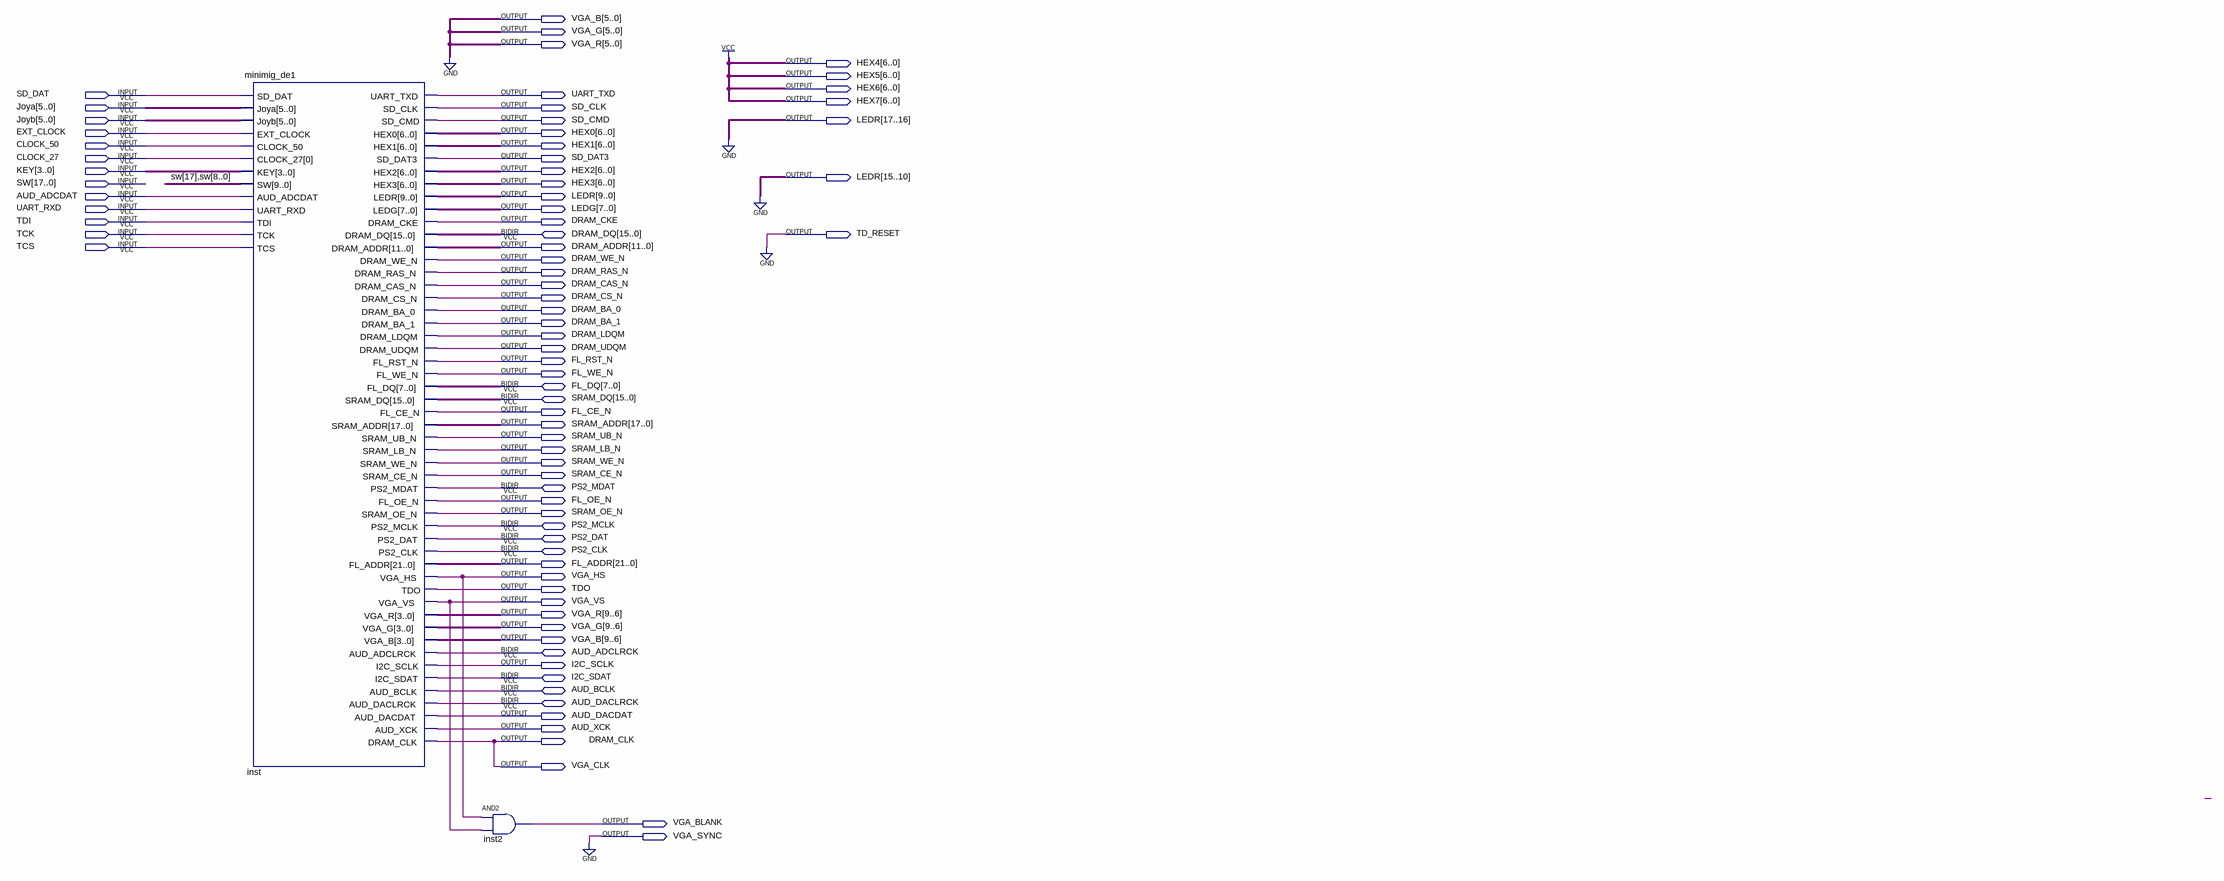
[diagram p0: schematic sheet]
// Quartus schematic minimig_de2.bdf as structural Verilog: 2 symbols, 78 pins
module minimig_de2 (
  input  SD_DAT,
  input  [5:0] Joya,
  input  [5:0] Joyb,
  input  EXT_CLOCK,
  input  CLOCK_50,
  input  CLOCK_27,
  input  [3:0] KEY,
  input  [17:0] SW,
  input  AUD_ADCDAT,
  input  UART_RXD,
  input  TDI,
  input  TCK,
  input  TCS,
  inout  [15:0] DRAM_DQ,
  inout  [7:0] FL_DQ,
  inout  [15:0] SRAM_DQ,
  inout  PS2_MDAT,
  inout  PS2_MCLK,
  inout  PS2_DAT,
  inout  PS2_CLK,
  inout  AUD_ADCLRCK,
  inout  I2C_SDAT,
  inout  AUD_BCLK,
  inout  AUD_DACLRCK,
  output [9:0] VGA_B,
  output [9:0] VGA_G,
  output [9:0] VGA_R,
  output [6:0] HEX4,
  output [6:0] HEX5,
  output [6:0] HEX6,
  output UART_TXD,
  output [6:0] HEX7,
  output SD_CLK,
  output SD_CMD,
  output [17:0] LEDR,
  output [6:0] HEX0,
  output [6:0] HEX1,
  output SD_DAT3,
  output [6:0] HEX2,
  output [6:0] HEX3,
  output [7:0] LEDG,
  output DRAM_CKE,
  output TD_RESET,
  output [11:0] DRAM_ADDR,
  output DRAM_WE_N,
  output DRAM_RAS_N,
  output DRAM_CAS_N,
  output DRAM_CS_N,
  output DRAM_BA_0,
  output DRAM_BA_1,
  output DRAM_LDQM,
  output DRAM_UDQM,
  output FL_RST_N,
  output FL_WE_N,
  output FL_CE_N,
  output [17:0] SRAM_ADDR,
  output SRAM_UB_N,
  output SRAM_LB_N,
  output SRAM_WE_N,
  output SRAM_CE_N,
  output FL_OE_N,
  output SRAM_OE_N,
  output [21:0] FL_ADDR,
  output VGA_HS,
  output TDO,
  output VGA_VS,
  output I2C_SCLK,
  output AUD_DACDAT,
  output AUD_XCK,
  output DRAM_CLK,
  output VGA_CLK,
  output VGA_BLANK,
  output VGA_SYNC
);

  minimig_de1 inst (
    .SD_DAT(SD_DAT), .Joya(Joya), .Joyb(Joyb), .EXT_CLOCK(EXT_CLOCK), .CLOCK_50(CLOCK_50),
    .CLOCK_27(CLOCK_27), .KEY(KEY), .SW({SW[17], SW[8:0]}), .AUD_ADCDAT(AUD_ADCDAT), .UART_RXD(UART_RXD),
    .TDI(TDI), .TCK(TCK), .TCS(TCS), .UART_TXD(UART_TXD), .SD_CLK(SD_CLK), .SD_CMD(SD_CMD), .HEX0(HEX0),
    .HEX1(HEX1), .SD_DAT3(SD_DAT3), .HEX2(HEX2), .HEX3(HEX3), .LEDR(LEDR[9:0]), .LEDG(LEDG),
    .DRAM_CKE(DRAM_CKE), .DRAM_ADDR(DRAM_ADDR), .DRAM_WE_N(DRAM_WE_N), .DRAM_RAS_N(DRAM_RAS_N),
    .DRAM_CAS_N(DRAM_CAS_N), .DRAM_CS_N(DRAM_CS_N), .DRAM_BA_0(DRAM_BA_0), .DRAM_BA_1(DRAM_BA_1),
    .DRAM_LDQM(DRAM_LDQM), .DRAM_UDQM(DRAM_UDQM), .FL_RST_N(FL_RST_N), .FL_WE_N(FL_WE_N), .FL_CE_N(FL_CE_N),
    .SRAM_ADDR(SRAM_ADDR), .SRAM_UB_N(SRAM_UB_N), .SRAM_LB_N(SRAM_LB_N), .SRAM_WE_N(SRAM_WE_N),
    .SRAM_CE_N(SRAM_CE_N), .FL_OE_N(FL_OE_N), .SRAM_OE_N(SRAM_OE_N), .FL_ADDR(FL_ADDR), .VGA_HS(VGA_HS),
    .TDO(TDO), .VGA_VS(VGA_VS), .VGA_R(VGA_R[9:6]), .VGA_G(VGA_G[9:6]), .VGA_B(VGA_B[9:6]),
    .I2C_SCLK(I2C_SCLK), .AUD_DACDAT(AUD_DACDAT), .AUD_XCK(AUD_XCK), .DRAM_CLK(DRAM_CLK), .DRAM_DQ(DRAM_DQ),
    .FL_DQ(FL_DQ), .SRAM_DQ(SRAM_DQ), .PS2_MDAT(PS2_MDAT), .PS2_MCLK(PS2_MCLK), .PS2_DAT(PS2_DAT),
    .PS2_CLK(PS2_CLK), .AUD_ADCLRCK(AUD_ADCLRCK), .I2C_SDAT(I2C_SDAT), .AUD_BCLK(AUD_BCLK),
    .AUD_DACLRCK(AUD_DACLRCK));
  and inst2 (VGA_BLANK, VGA_HS, VGA_VS);

  assign HEX4 = {7{1'b1}};
  assign HEX5 = {7{1'b1}};
  assign HEX6 = {7{1'b1}};
  assign HEX7 = {7{1'b1}};
  assign LEDR[17:10] = {8{1'b0}};
  assign TD_RESET = 1'b0;
  assign VGA_B[5:0] = {6{1'b0}};
  assign VGA_CLK = DRAM_CLK;
  assign VGA_G[5:0] = {6{1'b0}};
  assign VGA_R[5:0] = {6{1'b0}};
  assign VGA_SYNC = 1'b0;
endmodule
